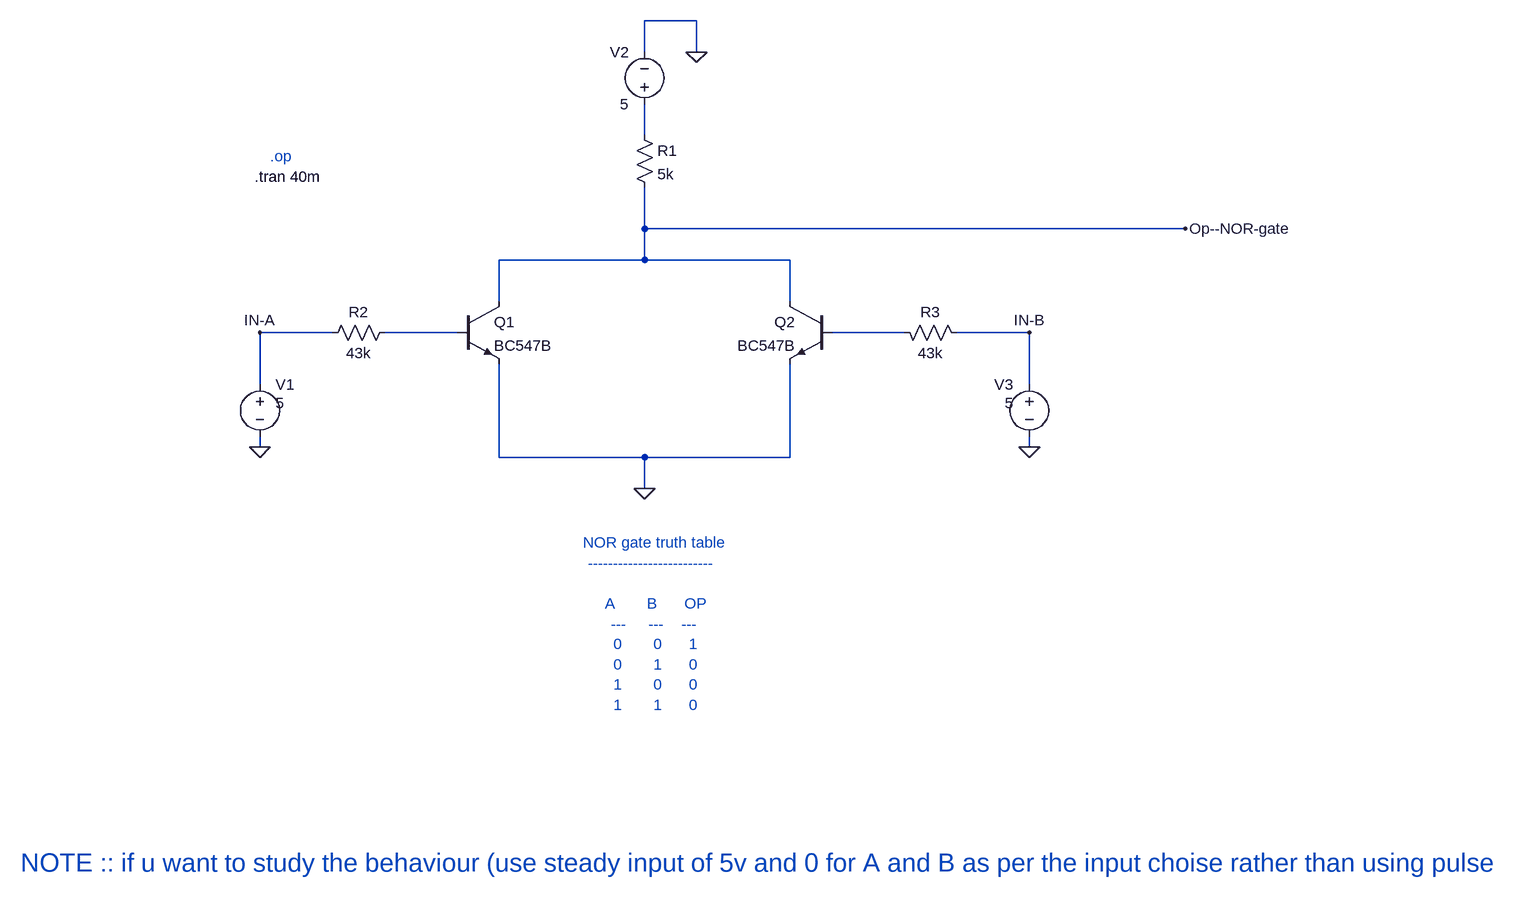
[diagram p0: schematic BJT_as_NOR_gate.asc]
BJT_as_NOR_gate.asc, the LTspice schematic file:
Version 4.1
SHEET 1 2536 1052
WIRE 432 -272 352 -272
WIRE 352 -224 352 -272
WIRE 432 -224 432 -272
WIRE 352 -96 352 -144
WIRE 352 48 352 -16
WIRE 1184 48 352 48
WIRE 352 96 352 48
WIRE 352 96 128 96
WIRE 576 96 352 96
WIRE 128 160 128 96
WIRE 576 160 576 96
WIRE -128 208 -240 208
WIRE 64 208 -48 208
WIRE 752 208 640 208
WIRE 944 208 832 208
WIRE -240 288 -240 208
WIRE 944 288 944 208
WIRE -240 384 -240 368
WIRE 944 384 944 368
WIRE 128 400 128 256
WIRE 352 400 128 400
WIRE 576 400 576 256
WIRE 576 400 352 400
WIRE 352 448 352 400
FLAG -240 208 IN-A
FLAG -240 384 0
FLAG 944 208 IN-B
FLAG 944 384 0
FLAG 352 448 0
FLAG 432 -224 0
FLAG 1184 48 Op--NOR-gate
SYMBOL voltage -240 272 R0
WINDOW 3 24 44 Left 2
WINDOW 123 0 0 Left 0
WINDOW 39 0 0 Left 0
SYMATTR Value 5
SYMATTR InstName V1
SYMBOL npn 64 160 R0
SYMATTR InstName Q1
SYMATTR Value BC547B
SYMBOL voltage 352 -128 R180
WINDOW 0 24 96 Left 2
WINDOW 3 24 16 Left 2
WINDOW 123 0 0 Left 0
WINDOW 39 0 0 Left 0
SYMATTR InstName V2
SYMATTR Value 5
SYMBOL res 336 -112 R0
SYMATTR InstName R1
SYMATTR Value 5k
SYMBOL res -32 192 R90
WINDOW 0 0 56 VBottom 2
WINDOW 3 32 56 VTop 2
SYMATTR InstName R2
SYMATTR Value 43k
SYMBOL voltage 944 272 M0
WINDOW 3 24 44 Left 2
WINDOW 123 0 0 Left 0
WINDOW 39 0 0 Left 0
SYMATTR Value 5
SYMATTR InstName V3
SYMBOL npn 640 160 M0
SYMATTR InstName Q2
SYMATTR Value BC547B
SYMBOL res 736 192 M90
WINDOW 0 0 56 VBottom 2
WINDOW 3 32 56 VTop 2
SYMATTR InstName R3
SYMATTR Value 43k
TEXT -248 -32 Left 2 !.tran 40m
TEXT -224 -64 Left 2 ;.op
TEXT 368 656 Center 2 ;NOR gate truth table\n-------------------------\n \nA       B      OP\n---     ---    ---\n0       0      1\n0       1      0\n1       0      0\n1       1      0
TEXT -608 1024 Left 4 ;NOTE :: if u want to study the behaviour (use steady input of 5v and 0 for A and B as per the input choise rather than using pulse

The netlist it stands for:
* BJT_as_NOR_gate.asc
V1 IN-A 0 5
Q1 Op--NOR-gate N002 0 0 BC547B
V2 N001 0 5
R1 N001 Op--NOR-gate 5k
R2 N002 IN-A 43k
V3 IN-B 0 5
Q2 Op--NOR-gate N003 0 0 BC547B
R3 N003 IN-B 43k
.model NPN NPN
.model PNP PNP
.lib standard.bjt
.tran 40m
* .op
* NOR gate truth table
* -------------------------
* A       B      OP
* ---     ---    ---
* 0       0      1
* 0       1      0
* 1       0      0
* 1       1      0
* NOTE :: if u want to study the behaviour (use steady input of 5v and 0 for A and B as per the input choise rather than using pulse
.backanno
.end